# EAGLE design CFA_s (EAGLE 9.4.2)
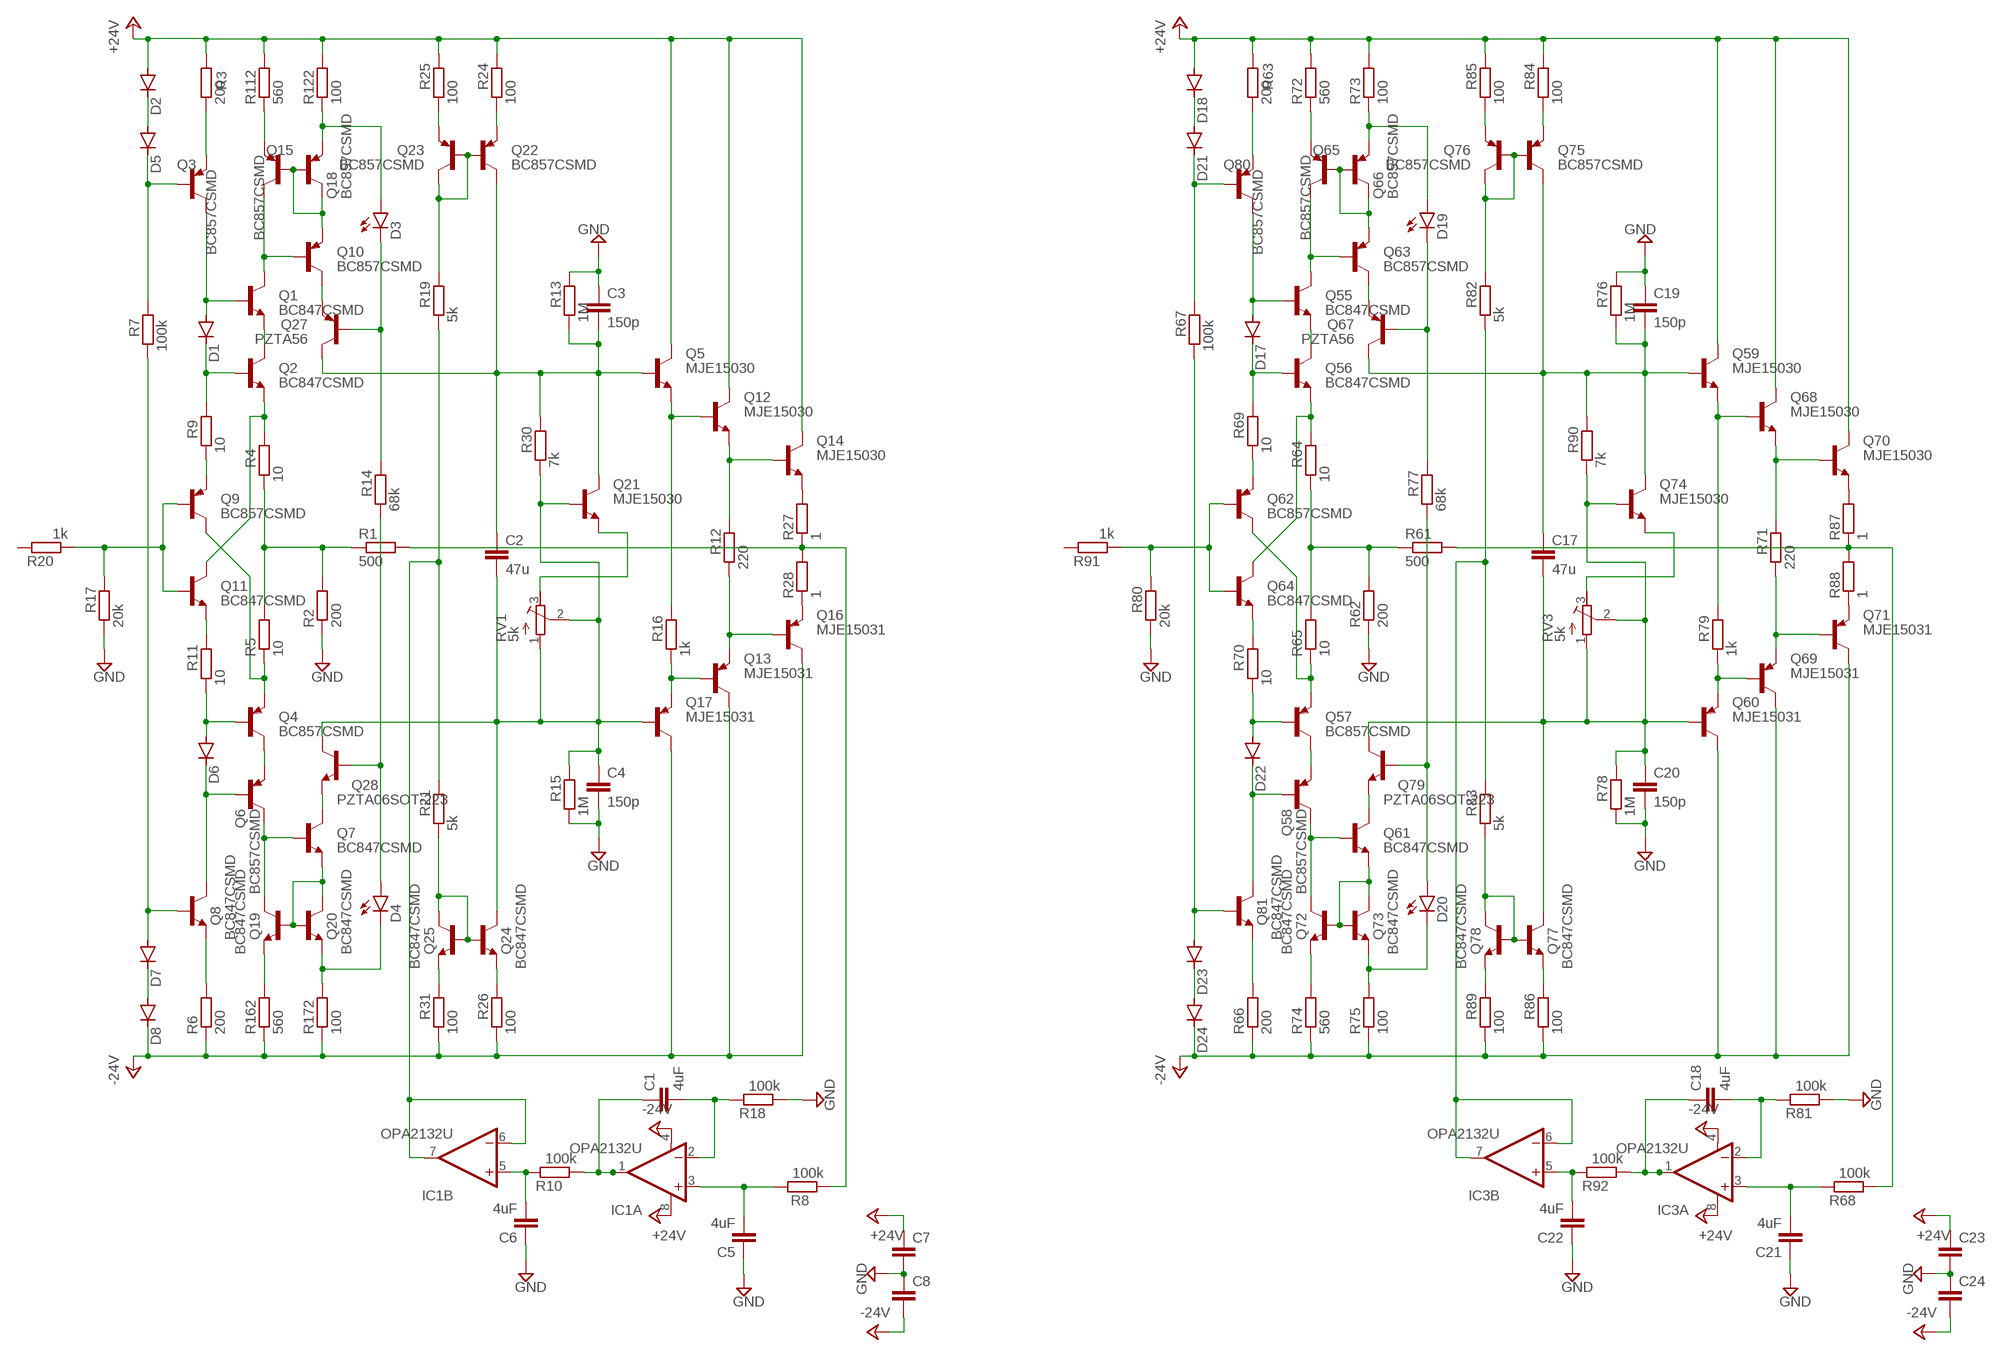
[diagram p0: schematic, sheet 1]

## Parts
C1  4uF  C-EUC1210  [C1210]
C2  47u  C-EUC1210  [C1210]
C3  150p  C-EUC0805  [C0805]
C4  150p  C-EUC0805  [C0805]
C5  4uF  C-EUC1210  [C1210]
C6  4uF  C-EUC1210  [C1210]
C7  C-EUC0603K  [C0603K]
C8  C-EUC0603K  [C0603K]
C17  47u  C-EUC1210  [C1210]
C18  4uF  C-EUC1210  [C1210]
C19  150p  C-EUC0805  [C0805]
C20  150p  C-EUC0805  [C0805]
C21  4uF  C-EUC1210  [C1210]
C22  4uF  C-EUC1210  [C1210]
C23  C-EUC0603K  [C0603K]
C24  C-EUC0603K  [C0603K]
D1  DIODE-SOD80C  [SOD80C]
D2  DIODE-SOD80C  [SOD80C]
D3  LEDCHIPLED_1206  [CHIPLED_1206]
D4  LEDCHIPLED_1206  [CHIPLED_1206]
D5  DIODE-SOD80C  [SOD80C]
D6  DIODE-SOD80C  [SOD80C]
D7  DIODE-SOD80C  [SOD80C]
D8  DIODE-SOD80C  [SOD80C]
D17  DIODE-SOD80C  [SOD80C]
D18  DIODE-SOD80C  [SOD80C]
D19  LEDCHIPLED_1206  [CHIPLED_1206]
D20  LEDCHIPLED_1206  [CHIPLED_1206]
D21  DIODE-SOD80C  [SOD80C]
D22  DIODE-SOD80C  [SOD80C]
D23  DIODE-SOD80C  [SOD80C]
D24  DIODE-SOD80C  [SOD80C]
IC1  OPA2132U  [SO08]
IC3  OPA2132U  [SO08]
Q1  BC847CSMD  [SOT23]
Q2  BC847CSMD  [SOT23]
Q3  BC857CSMD  [SOT23-BEC]
Q4  BC857CSMD  [SOT23-BEC]
Q5  MJE15030  MJD31C  [DPAK]
Q6  BC857CSMD  [SOT23-BEC]
Q7  BC847CSMD  [SOT23]
Q8  BC847CSMD  [SOT23]
Q9  BC857CSMD  [SOT23-BEC]
Q10  BC857CSMD  [SOT23-BEC]
Q11  BC847CSMD  [SOT23]
Q12  MJE15030  MJD31C  [DPAK]
Q13  MJE15031  MJD32C  [DPAK]
Q14  MJE15030  MJD31C  [DPAK]
Q15  BC857CSMD  [SOT23-BEC]
Q16  MJE15031  MJD32C  [DPAK]
Q17  MJE15031  MJD32C  [DPAK]
Q18  BC857CSMD  [SOT23-BEC]
Q19  BC847CSMD  [SOT23]
Q20  BC847CSMD  [SOT23]
Q21  MJE15030  MJD31C  [DPAK]
Q22  BC857CSMD  [SOT23-BEC]
Q23  BC857CSMD  [SOT23-BEC]
Q24  BC847CSMD  [SOT23]
Q25  BC847CSMD  [SOT23]
Q27  PZTA56  [SOT223]
Q28  PZTA06SOT-223  [SOT223]
Q55  BC847CSMD  [SOT23]
Q56  BC847CSMD  [SOT23]
Q57  BC857CSMD  [SOT23-BEC]
Q58  BC857CSMD  [SOT23-BEC]
Q59  MJE15030  MJD31C  [DPAK]
Q60  MJE15031  MJD32C  [DPAK]
Q61  BC847CSMD  [SOT23]
Q62  BC857CSMD  [SOT23-BEC]
Q63  BC857CSMD  [SOT23-BEC]
Q64  BC847CSMD  [SOT23]
Q65  BC857CSMD  [SOT23-BEC]
Q66  BC857CSMD  [SOT23-BEC]
Q67  PZTA56  [SOT223]
Q68  MJE15030  MJD31C  [DPAK]
Q69  MJE15031  MJD32C  [DPAK]
Q70  MJE15030  MJD31C  [DPAK]
Q71  MJE15031  MJD32C  [DPAK]
Q72  BC847CSMD  [SOT23]
Q73  BC847CSMD  [SOT23]
Q74  MJE15030  MJD31C  [DPAK]
Q75  BC857CSMD  [SOT23-BEC]
Q76  BC857CSMD  [SOT23-BEC]
Q77  BC847CSMD  [SOT23]
Q78  BC847CSMD  [SOT23]
Q79  PZTA06SOT-223  [SOT223]
Q80  BC857CSMD  [SOT23-BEC]
Q81  BC847CSMD  [SOT23]
R1  500  R-EU_MELF0204W  [MINI_MELF-0204W]
R2  200  R-EU_MELF0204W  [MINI_MELF-0204W]
R3  200  R-EU_MELF0204W  [MINI_MELF-0204W]
R4  10  R-EU_MELF0204W  [MINI_MELF-0204W]
R5  10  R-EU_MELF0204W  [MINI_MELF-0204W]
R6  200  R-EU_MELF0204W  [MINI_MELF-0204W]
R7  100k  R-EU_MELF0204W  [MINI_MELF-0204W]
R8  100k  R-EU_MELF0204W  [MINI_MELF-0204W]
R9  10  R-EU_MELF0204W  [MINI_MELF-0204W]
R10  100k  R-EU_MELF0204W  [MINI_MELF-0204W]
R11  10  R-EU_MELF0204W  [MINI_MELF-0204W]
R12  220  R-EU_MELF0204W  [MINI_MELF-0204W]
R13  1M  R-EU_MELF0204W  [MINI_MELF-0204W]
R14  68k  R-EU_MELF0204W  [MINI_MELF-0204W]
R15  1M  R-EU_MELF0204W  [MINI_MELF-0204W]
R16  1k  R-EU_MELF0204W  [MINI_MELF-0204W]
R17  20k  R-EU_MELF0204W  [MINI_MELF-0204W]
R18  100k  R-EU_MELF0204W  [MINI_MELF-0204W]
R19  5k  R-EU_MELF0204W  [MINI_MELF-0204W]
R20  1k  R-EU_MELF0204W  [MINI_MELF-0204W]
R21  5k  R-EU_MELF0204W  [MINI_MELF-0204W]
R24  100  R-EU_MELF0204W  [MINI_MELF-0204W]
R25  100  R-EU_MELF0204W  [MINI_MELF-0204W]
R26  100  R-EU_MELF0204W  [MINI_MELF-0204W]
R27  1  R-EU_R4527  [R4527]
R28  1  R-EU_R4527  [R4527]
R30  7k  R-EU_MELF0204W  [MINI_MELF-0204W]
R31  100  R-EU_MELF0204W  [MINI_MELF-0204W]
R61  500  R-EU_MELF0204W  [MINI_MELF-0204W]
R62  200  R-EU_MELF0204W  [MINI_MELF-0204W]
R63  200  R-EU_MELF0204W  [MINI_MELF-0204W]
R64  10  R-EU_MELF0204W  [MINI_MELF-0204W]
R65  10  R-EU_MELF0204W  [MINI_MELF-0204W]
R66  200  R-EU_MELF0204W  [MINI_MELF-0204W]
R67  100k  R-EU_MELF0204W  [MINI_MELF-0204W]
R68  100k  R-EU_MELF0204W  [MINI_MELF-0204W]
R69  10  R-EU_MELF0204W  [MINI_MELF-0204W]
R70  10  R-EU_MELF0204W  [MINI_MELF-0204W]
R71  220  R-EU_MELF0204W  [MINI_MELF-0204W]
R72  560  R-EU_MELF0204W  [MINI_MELF-0204W]
R73  100  R-EU_MELF0204W  [MINI_MELF-0204W]
R74  560  R-EU_MELF0204W  [MINI_MELF-0204W]
R75  100  R-EU_MELF0204W  [MINI_MELF-0204W]
R76  1M  R-EU_MELF0204W  [MINI_MELF-0204W]
R77  68k  R-EU_MELF0204W  [MINI_MELF-0204W]
R78  1M  R-EU_MELF0204W  [MINI_MELF-0204W]
R79  1k  R-EU_MELF0204W  [MINI_MELF-0204W]
R80  20k  R-EU_MELF0204W  [MINI_MELF-0204W]
R81  100k  R-EU_MELF0204W  [MINI_MELF-0204W]
R82  5k  R-EU_MELF0204W  [MINI_MELF-0204W]
R83  5k  R-EU_MELF0204W  [MINI_MELF-0204W]
R84  100  R-EU_MELF0204W  [MINI_MELF-0204W]
R85  100  R-EU_MELF0204W  [MINI_MELF-0204W]
R86  100  R-EU_MELF0204W  [MINI_MELF-0204W]
R87  1  R-EU_R4527  [R4527]
R88  1  R-EU_R4527  [R4527]
R89  100  R-EU_MELF0204W  [MINI_MELF-0204W]
R90  7k  R-EU_MELF0204W  [MINI_MELF-0204W]
R91  1k  R-EU_MELF0204W  [MINI_MELF-0204W]
R92  100k  R-EU_MELF0204W  [MINI_MELF-0204W]
R112  560  R-EU_MELF0204W  [MINI_MELF-0204W]
R122  100  R-EU_MELF0204W  [MINI_MELF-0204W]
R162  560  R-EU_MELF0204W  [MINI_MELF-0204W]
R172  100  R-EU_MELF0204W  [MINI_MELF-0204W]
RV1  5k  R-TRIMMTS63Y  [RTRIMTS63Y]
RV3  5k  R-TRIMMTS63Y  [RTRIMTS63Y]

## Nets
+24V: C7.1 C23.1 D2.A D18.A IC1.8(A:V+) IC3.8(A:V+) Q5.4(C) Q12.4(C) Q14.4(C) Q59.4(C) Q68.4(C) Q70.4(C) R3.2 R24.2 R25.2 R63.2 R72.2 R73.2 R84.2 R85.2 R112.2 R122.2
-24V: C8.2 C24.2 D8.C D24.C IC1.4(A:V-) IC3.4(A:V-) Q13.4(C) Q16.4(C) Q17.4(C) Q60.4(C) Q69.4(C) Q71.4(C) R6.1 R26.1 R31.1 R66.1 R74.1 R75.1 R86.1 R89.1 R162.1 R172.1
GND: C3.1 C4.2 C5.1 C6.1 C7.2 C8.1 C19.1 C20.2 C21.1 C22.1 C23.2 C24.1 R2.1 R13.2 R15.1 R17.1 R18.1 R62.1 R76.2 R78.1 R80.1 R81.1
N$1: Q21.3(E) RV1.3(E)
N$2: Q3.E R3.1
N$3: D1.A Q1.1(B) Q3.C
N$4: D2.C D5.A
N$5: D5.C Q3.B R7.2
N$6: D1.C Q2.1(B) R9.2
N$7: Q1.2(E) Q2.3(C)
N$8: Q2.2(E) Q11.3(C) R4.2
N$9: R1.1 R2.2 R4.1 R5.2
N$10: Q4.E Q9.C R5.1
N$11: Q4.C Q6.E
N$12: D6.A Q4.B R11.1
N$13: D6.C Q6.B Q8.3(C)
N$14: Q8.2(E) R6.2
N$15: D7.A Q8.1(B) R7.1
N$16: D7.C D8.A
N$17: C1.1 IC1.1(A:OUT) R10.1
N$18: C6.2 IC1.5(B:+IN) R10.2
N$19: Q9.E R9.1
N$20: Q11.2(E) R11.2
N$21: Q15.E R112.1
N$22: Q9.B Q11.1(B) R17.2 R20.1
N$23: Q1.3(C) Q10.B Q15.C
N$24: Q10.E Q15.B Q18.B Q18.C
N$25: D3.A Q18.E R122.1
N$26: Q10.C Q27.3(E)
N$27: D3.C Q27.1(B) R14.2
N$28: Q7.2(E) Q19.1(B) Q20.1(B) Q20.3(C)
N$29: D4.C Q20.2(E) R172.2
N$30: Q19.2(E) R162.2
N$31: Q6.C Q7.1(B) Q19.3(C)
N$32: Q7.3(C) Q28.3(E)
N$33: D4.A Q28.1(B) R14.1
N$35: Q12.3(E) Q14.1(B) R12.2
N$36: C2.1 C3.2 Q5.1(B) Q21.4(C) Q22.C Q27.2(C) Q27.4(C) R13.1 R30.2
N$37: Q22.B Q23.B Q23.C R19.2
N$38: Q24.1(B) Q25.1(B) Q25.3(C) R21.1
N$39: Q23.E R25.1
N$40: Q22.E R24.1
N$41: IC1.6(B:-IN) IC1.7(B:OUT) R19.1 R21.2
N$42: R1.2 R8.1 R27.1 R28.2
N$43: Q25.2(E) R31.2
N$44: Q24.2(E) R26.2
N$45: Q5.3(E) Q12.1(B) R16.2
N$47: Q13.1(B) Q17.3(E) R16.1
N$48: C2.2 C4.1 Q17.1(B) Q21.1(B) Q24.3(C) Q28.2(C) Q28.4(C) R15.2 R30.1 RV1.1(A) RV1.2(S)
N$50: Q13.3(E) Q16.1(B) R12.1
N$51: Q14.3(E) R27.2
N$52: Q16.3(E) R28.1
N$53: C1.2 IC1.2(A:-IN) R18.2
N$55: C5.2 IC1.3(A:+IN) R8.2
N$183: Q80.E R63.1
N$184: D17.A Q55.1(B) Q80.C
N$185: D18.C D21.A
N$186: D21.C Q80.B R67.2
N$187: D17.C Q56.1(B) R69.2
N$188: Q55.2(E) Q56.3(C)
N$189: Q56.2(E) Q64.3(C) R64.2
N$190: R61.1 R62.2 R64.1 R65.2
N$191: Q57.E Q62.C R65.1
N$192: D22.A Q57.B R70.1
N$193: D22.C Q58.B Q81.3(C)
N$194: Q81.2(E) R66.2
N$195: D23.C D24.A
N$196: Q57.C Q58.E
N$197: Q62.E R69.1
N$198: Q64.2(E) R70.2
N$199: Q62.B Q64.1(B) R80.2 R91.1
N$200: Q55.3(C) Q63.B Q65.C
N$201: Q63.E Q65.B Q66.B Q66.C
N$202: Q65.E R72.1
N$203: D19.A Q66.E R73.1
N$204: Q63.C Q67.3(E)
N$205: D19.C Q67.1(B) R77.2
N$206: Q61.2(E) Q72.1(B) Q73.1(B) Q73.3(C)
N$207: D20.C Q73.2(E) R75.2
N$208: Q72.2(E) R74.2
N$209: Q58.C Q61.1(B) Q72.3(C)
N$210: Q61.3(C) Q79.3(E)
N$211: D20.A Q79.1(B) R77.1
N$212: C17.1 C19.2 Q59.1(B) Q67.2(C) Q67.4(C) Q74.4(C) Q75.C R76.1 R90.2
N$213: Q75.B Q76.B Q76.C R82.2
N$214: Q77.1(B) Q78.1(B) Q78.3(C) R83.1
N$215: Q76.E R85.1
N$216: Q75.E R84.1
N$217: IC3.6(B:-IN) IC3.7(B:OUT) R82.1 R83.2
N$218: R61.2 R68.1 R87.1 R88.2
N$219: Q78.2(E) R89.2
N$220: Q77.2(E) R86.2
N$221: Q59.3(E) Q68.1(B) R79.2
N$222: Q60.3(E) Q69.1(B) R79.1
N$223: C17.2 C20.1 Q60.1(B) Q74.1(B) Q77.3(C) Q79.2(C) Q79.4(C) R78.2 R90.1 RV3.1(A) RV3.2(S)
N$224: Q68.3(E) Q70.1(B) R71.2
N$225: Q69.3(E) Q71.1(B) R71.1
N$226: Q70.3(E) R87.2
N$227: Q71.3(E) R88.1
N$228: C18.2 IC3.2(A:-IN) R81.2
N$229: C21.2 IC3.3(A:+IN) R68.2
N$230: D23.A Q81.1(B) R67.1
N$231: Q74.3(E) RV3.3(E)
N$232: C18.1 IC3.1(A:OUT) R92.1
N$233: C22.2 IC3.5(B:+IN) R92.2
Unconnected: R20.2 R91.2

## Library data of the parts
C1-C6 C17-C22 = Vwvwbg:C-EU: CAPACITOR, European symbol; SPICEPREFIX: C
C7 C8 C23 C24 = Vwvwbg:C-EU: CAPACITOR, European symbol
D1 D2 D5-D8 D17 D18 D21-D24 = diode:DIODE-: DIODE; SPICEPREFIX: D
D3 D4 D19 D20 = led:LED: LED OSRAM: - CHIPLED LG R971, LG N971, LY N971, LG Q971, LY Q971, LO R971, LY R971 LH N974, LH R974 LS Q976, LO Q976, LY Q976 LO Q996 - Hyper CHIPLED LW Q18S LB Q993, LB Q99A, LB R99A - SideLED LS A670, LO A670, LY A670, LG A670, LP A670 LB A673, LV A673, LT A673, LW A673 LH A674 LY A675 LS A676, LA A676, LO A676, LY A676, LW A676 LS A679, LY A679, LG A679 - Hyper Micro SIDELED® LS Y876, LA Y876, LO Y876, LY Y876 LT Y87S - SmartLED LW L88C, LW L88S LB L89C, LB L89S, LG L890 LS L89K, LO L89K, LY L89K LS L896, LA L896, LO L896, LY L896 - TOPLED LS T670, LO T670, LY T670, LG T670, LP T670 LSG T670, LSP T670, LSY T670, LOP T670, LYG T670 LG T671, LOG T671, LSG T671 LB T673, LV T673, LT T673, LW T673 LH T674 LS T676, LA T676, LO T676, LY T676, LB T676, LH T676, LSB T676, LW T676 LB T67C, LV T67C, LT T67C, LS T67K, LO T67K, LY T67K, LW E67C LS E67B, LA E67B, LO E67B, LY E67B, LB E67C, LV E67C, LT E67C LW T67C LS T679, LY T679, LG T679 LS T770, LO T770, LY T770, LG T770, LP T770 LB T773, LV T773, LT T773, LW T773 LH T774 LS E675, LA E675, LY E675, LS T675 LS T776, LA T776, LO T776, LY T776, LB T776 LHGB T686 LT T68C, LB T68C - Hyper Mini TOPLED® LB M676 - Mini TOPLED Santana® LG M470 LS M47K, LO M47K, LY M47K Source: http://www.osram.convergy.de LUXEON: - LUMILED® LXK2-PW12-R00, LXK2-PW12-S00, LXK2-PW14-U00, LXK2-PW14-V00 LXK2-PM12-R00, LXK2-PM12-S00, LXK2-PM14-U00 LXK2-PE12-Q00, LXK2-PE12-R00, LXK2-PE12-S00, LXK2-PE14-T00, LXK2-PE14-U00 LXK2-PB12-K00, LXK2-PB12-L00, LXK2-PB12-M00, LXK2-PB14-N00, LXK2-PB14-P00, LXK2-PB14-Q00 LXK2-PR12-L00, LXK2-PR12-M00, LXK2-PR14-Q00, LXK2-PR14-R00 LXK2-PD12-Q00, LXK2-PD12-R00, LXK2-PD12-S00 LXK2-PH12-R00, LXK2-PH12-S00 LXK2-PL12-P00, LXK2-PL12-Q00, LXK2-PL12-R00 Source: www.luxeon.com KINGBRIGHT: KA-3528ASYC Source: www.kingbright.com; SPICEPREFIX: D
IC1 IC3 = burr-brown:OPA2132: High Speed FET-Input Operational Amplifiers< Product Folder:OPA2132; MF: TEXAS INSTRUMENTS; MPN: OPA2132U; OC_FARNELL: 1206934; OC_NEWARK: 80K6015
Q1 Q2 Q7 Q8 Q11 Q19 Q20 Q24 Q25 Q55 Q56 Q61 Q64 Q72 Q73 Q77 Q78 Q81 = transistor-npn:BC847*: NPN Transistor; SPICEPREFIX: Q
Q3 Q4 Q6 Q9 Q10 Q15 Q18 Q22 Q23 Q57 Q58 Q62 Q63 Q65 Q66 Q75 Q76 Q80 = transistor-pnp:BC857*: PNP Transistror; SPICEPREFIX: Q
Q5 Q12 Q14 Q21 Q59 Q68 Q70 Q74 = transistor:MJD31*: Complementary Power Transistors; SPICEPREFIX: Q
Q13 Q16 Q17 Q60 Q69 Q71 = transistor:MJD32*: Complementary Power Transistors; SPICEPREFIX: Q
Q27 Q67 = Vwvwbg:PZTA56; SPICEPREFIX: Q
Q28 Q79 = Vwvwbg:PZTA06; SPICEPREFIX: Q
R1-R21 R24-R28 R30 R31 R61-R92 R112 R122 R162 R172 = Vwvwbg:R-EU_: RESISTOR, European symbol; SPICEPREFIX: R
RV1 RV3 = Vwvwbg:R-TRIMM: Trimm resistor; SPICEMODEL: X; SPICEPREFIX: Z; SPICEPREFIXL: POT

## Board
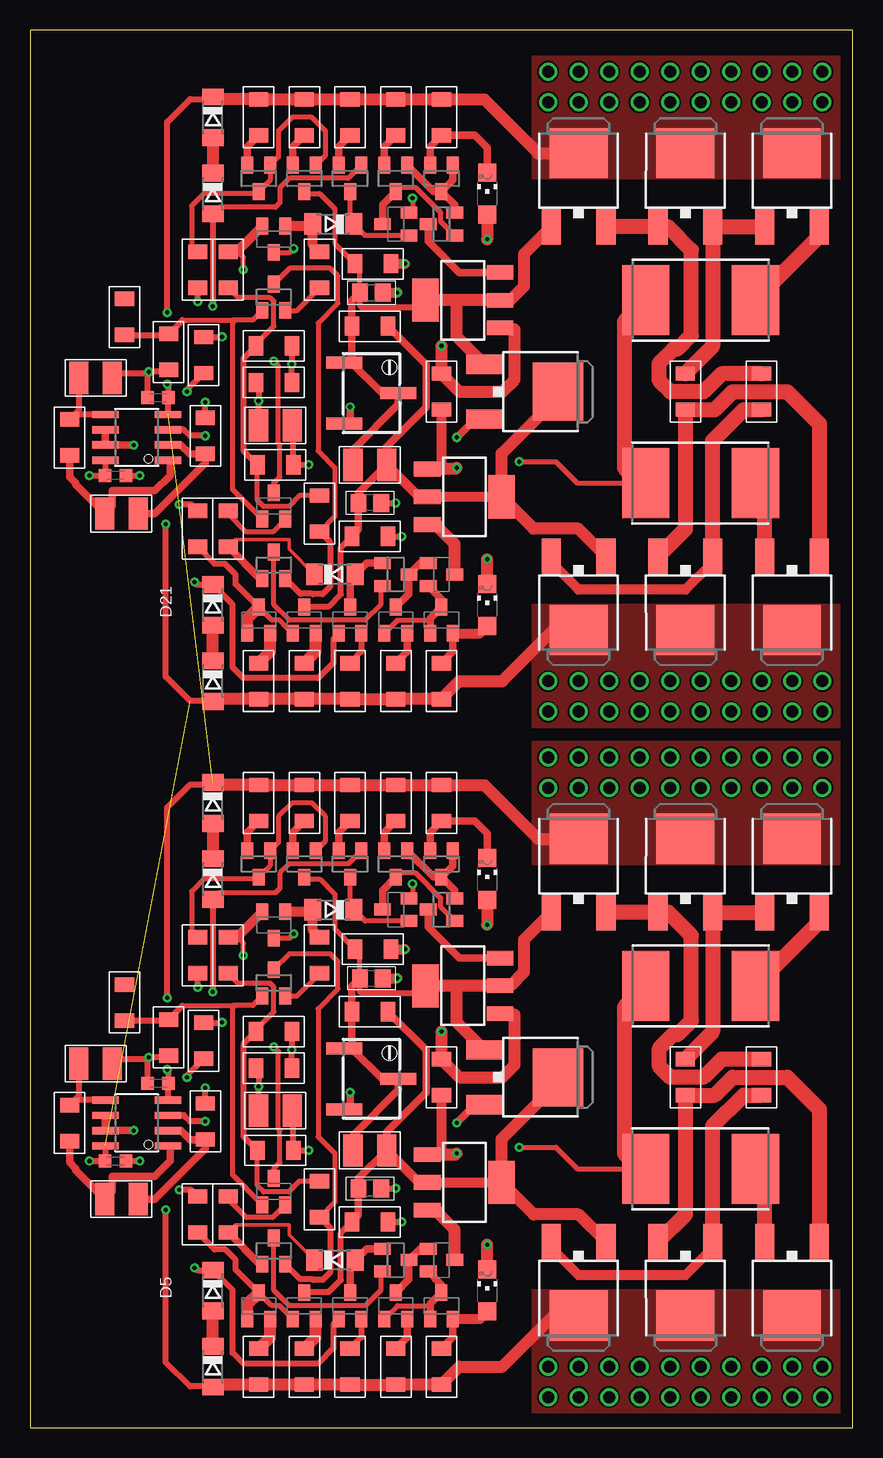
[diagram p1: board, top side]
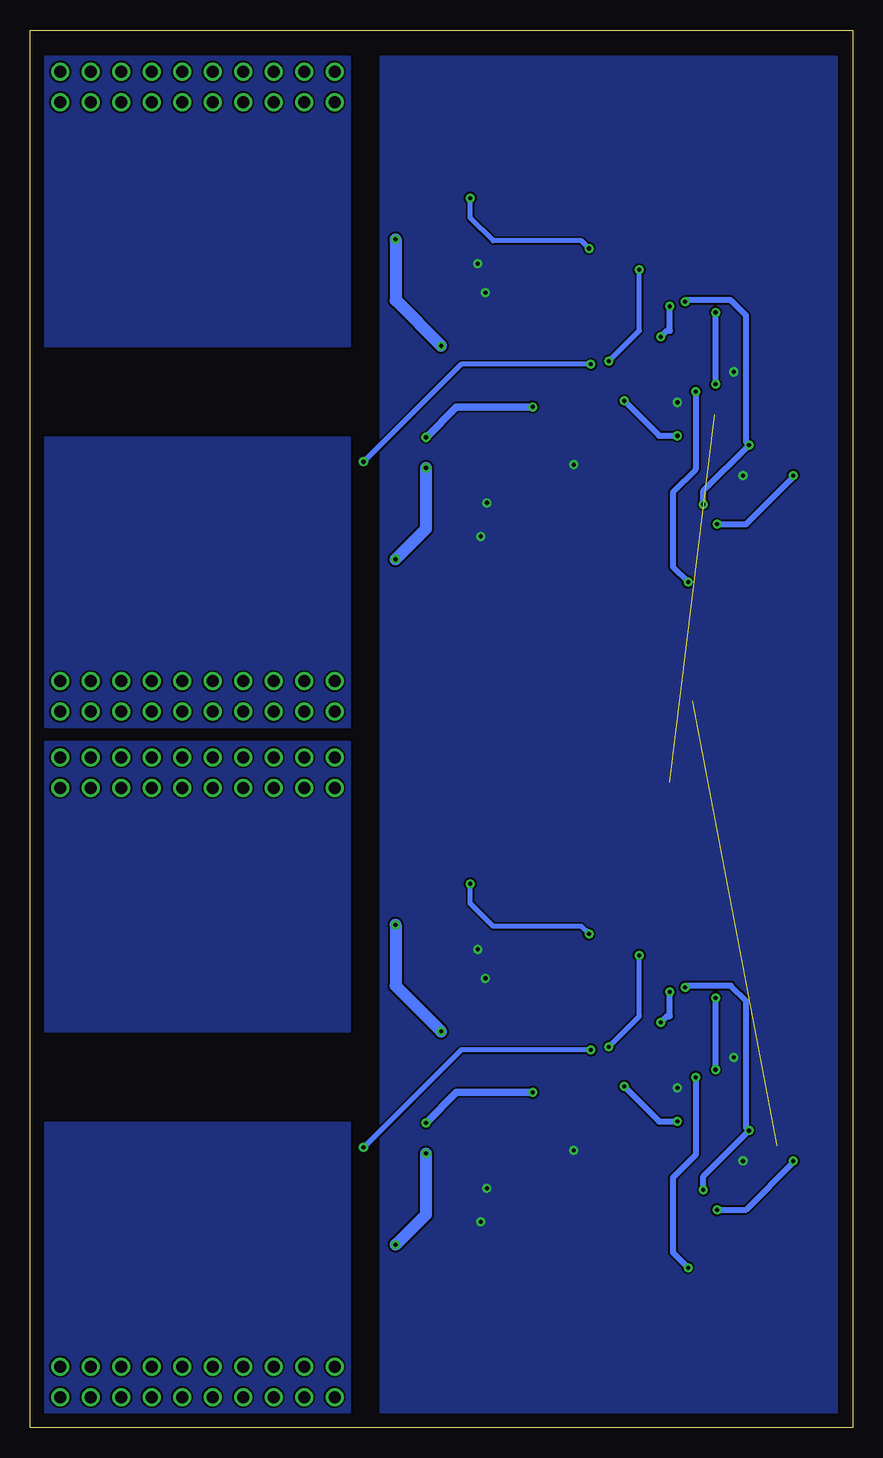
[diagram p2: board, bottom side, seen from below]

Size 68.56 x 116.51 mm. Coordinates in mm from the lower left corner, seen from the top.
Outline: 0,0 68.56,0 68.56,116.51 0,116.51 0,0
Copper layers (1*16): Top 0.035mm / dielectric 1.5mm / Bottom 0.035mm
Design rules "default *": minimum track width 6mil, minimum drill 0.35mm, track to track 6mil, track to pad 6mil, pad to pad 6mil, via to via 6mil, smd to smd 6mil, copper to edge 40mil, drill to drill 6mil, minimum pad ring 10mil, minimum via ring 8mil, stop-mask expansion 4mil, vias tented up to drill 0.35mm, thermal gap 10mil

### Footprints (pad centres in the part's own frame; a part is rotated, then mirrored left to right if it is on the bottom)
C1210 = smd 1.6 x 2.7: 1 -1.4,0; 2 1.4,0
C0805 = smd 1.3 x 1.5: 1 -0.95,0; 2 0.95,0
C0603K = smd 1.05 x 1.08: 1 -0.875,0; 2 0.875,0
SOD80C = smd 1.4 x 1.8: A 1.7,0; C -1.7,0
CHIPLED_1206 = smd 1.5 x 1.5: A 0,-1.75; C 0,1.75
SO08 = smd 0.61 x 2.21: 1 -1.905,-2.616; 2 -0.635,-2.616; 3 0.635,-2.616; 4 1.905,-2.616; 5 1.905,2.616; 6 0.635,2.616; 7 -0.635,2.616; 8 -1.905,2.616
SOT23 = smd 1 x 1.4: 1 -0.95,-1.1; 2 0.95,-1.1; 3 0,1.1
SOT23-BEC = smd 1 x 1.4: B -0.95,-1.1; C 0,1.1; E 0.95,-1.1
DPAK = smd 1.6 x 3: 1 -2.28,-4.04; 3 2.28,-4.04 | smd 4.826 x 4.191: 4 0,2.096
SOT223 = smd 1.219 x 2.235: 1 -2.311,-3.099; 2 0,-3.099; 3 2.311,-3.099 | smd 3.6 x 2.2: 4 0,3.099
MINI_MELF-0204W = smd 1.2 x 1.6: 1 -1.5,0; 2 1.5,0
R4527 = smd 3.94 x 5.84: 1 -4.575,0; 2 4.575,0
RTRIMTS63Y = smd 1 x 3: 1 -2.55,-2.25; 2 0,2.25; 3 2.55,-2.25

### Placement (x,y rotation side)
C1  7.62,19.05 0 top
C2  28.32,23.11 180 top
C3  28.32,19.94 180 top
C4  28.45,37.47 0 top
C5  20.45,26.42 180 top
C6  5.46,30.35 180 top
C7  7.11,22.22 0 top
C8  10.67,28.7 0 top
C17  28.32,80.26 180 top
C18  7.62,76.2 0 top
C19  28.32,77.09 180 top
C20  28.45,94.61 0 top
C21  20.45,83.57 180 top
C22  5.46,87.5 180 top
C23  7.11,79.38 0 top
C24  10.67,85.85 0 top
D1  25.4,13.97 0 top
D2  15.24,5.08 270 top
D3  38.1,11.43 0 top
D4  38.1,45.72 0 top
D5  15.24,11.43 270 top
D6  25.27,43.18 180 top
D7  15.24,45.72 270 top
D8  15.24,52.07 270 top
D17  25.4,71.12 0 top
D18  15.24,62.23 270 top
D19  38.1,68.58 0 top
D20  38.1,102.87 0 top
D21  15.24,68.58 270 top
D22  25.27,100.33 180 top
D23  15.24,102.87 270 top
D24  15.24,109.22 270 top
IC1  8.89,25.4 90 top
IC3  8.89,82.55 90 top
Q1  30.48,13.97 270 top
Q2  20.32,14.73 0 top
Q3  26.67,10.16 0 top
Q4  20.32,41.91 180 top
Q5  45.72,11.43 180 top
Q6  30.48,43.18 90 top
Q7  34.29,43.18 90 top
Q8  26.67,46.99 180 top
Q9  20.32,19.68 0 top
Q10  34.29,13.97 270 top
Q11  20.32,37.08 0 top
Q12  54.61,11.43 180 top
Q13  54.61,46.99 0 top
Q14  63.5,11.43 180 top
Q15  30.48,10.16 0 top
Q16  63.5,46.99 0 top
Q17  45.72,46.99 0 top
Q18  34.29,10.16 0 top
Q19  30.48,46.99 180 top
Q20  34.29,46.99 180 top
Q21  41.91,29.21 270 top
Q22  22.86,10.16 0 top
Q23  19.05,10.16 0 top
Q24  22.86,46.99 180 top
Q25  19.05,46.99 180 top
Q27  36.2,20.45 270 top
Q28  36.07,36.83 90 top
Q55  30.48,71.12 270 top
Q56  20.32,71.88 0 top
Q57  20.32,99.06 180 top
Q58  30.48,100.33 90 top
Q59  45.72,68.58 180 top
Q60  45.72,104.14 0 top
Q61  34.29,100.33 90 top
Q62  20.32,76.83 0 top
Q63  34.29,71.12 270 top
Q64  20.32,94.23 0 top
Q65  30.48,67.31 0 top
Q66  34.29,67.31 0 top
Q67  36.2,77.6 270 top
Q68  54.61,68.58 180 top
Q69  54.61,104.14 0 top
Q70  63.5,68.58 180 top
Q71  63.5,104.14 0 top
Q72  30.48,104.14 180 top
Q73  34.29,104.14 180 top
Q74  41.91,86.36 270 top
Q75  22.86,67.31 0 top
Q76  19.05,67.31 0 top
Q77  22.86,104.14 180 top
Q78  19.05,104.14 180 top
Q79  36.07,93.98 90 top
Q80  26.67,67.31 0 top
Q81  26.67,104.14 180 top
R1  20.32,33.02 0 top
R2  20.45,23.11 180 top
R3  26.67,5.08 270 top
R4  24.13,19.05 270 top
R5  16.51,39.37 270 top
R6  26.67,52.07 270 top
R7  14.48,32.26 270 top
R8  20.32,29.97 180 top
R9  16.51,17.78 270 top
R10  3.3,25.4 90 top
R11  24.13,39.37 270 top
R12  54.61,29.21 270 top
R13  28.32,17.14 0 top
R14  34.29,29.21 270 top
R15  28.57,39.88 180 top
R16  60.96,29.21 270 top
R17  11.56,32.51 90 top
R18  14.61,25.53 270 top
R19  13.97,17.78 270 top
R20  7.87,35.43 90 top
R21  13.97,39.37 270 top
R24  22.86,5.08 270 top
R25  19.05,5.08 270 top
R26  22.86,52.07 270 top
R27  55.88,21.59 0 top
R28  55.88,36.83 180 top
R30  28.32,34.67 0 top
R31  19.05,52.07 270 top
R61  20.32,90.17 0 top
R62  20.45,80.26 180 top
R63  26.67,62.23 270 top
R64  24.13,76.2 270 top
R65  16.51,96.52 270 top
R66  26.67,109.22 270 top
R67  14.48,89.41 270 top
R68  20.32,87.12 180 top
R69  16.51,74.93 270 top
R70  24.13,96.52 270 top
R71  54.61,86.36 270 top
R72  30.48,62.23 270 top
R73  34.29,62.23 270 top
R74  30.48,109.22 270 top
R75  34.29,109.22 270 top
R76  28.32,74.3 0 top
R77  34.29,86.36 270 top
R78  28.57,97.03 180 top
R79  60.96,86.36 270 top
R80  11.56,89.66 90 top
R81  14.61,82.68 270 top
R82  13.97,74.93 270 top
R83  13.97,96.52 270 top
R84  22.86,62.23 270 top
R85  19.05,62.23 270 top
R86  22.86,109.22 270 top
R87  55.88,78.74 0 top
R88  55.88,93.98 180 top
R89  19.05,109.22 270 top
R90  28.32,91.82 0 top
R91  7.87,92.58 90 top
R92  3.3,82.55 90 top
R112  30.48,5.08 270 top
R122  34.29,5.08 270 top
R162  30.48,52.07 270 top
R172  34.29,52.07 270 top
RV1  28.45,29.08 270 top
RV3  28.45,86.23 270 top

### Tracks (layer width: path | path; a pad name or v marks a point on that pad's centre or on a via)
+24V  (via drill 0.35)  (1 unrouted)
  Top 0.508: IC1.8 6.27,22.26 C7.1 v4.95,22.22 | D2.A 15.19,3.43 13.34,3.43 11.3,5.46 v11.3,18.16 | IC3.8 6.27,79.41 C23.1 v4.95,79.38 | D18.A 15.19,60.58 13.34,60.58 11.3,62.61 v11.3,75.31
  Top 1.016: D2.A 15.44,3.58 R25.2 R24.2 R3.2 R112.2 R122.2 35.79,5.08 39.37,5.08 44.45,10.16 44.89,10.16 Q5.4 | D18.A 15.44,60.73 R85.2 R84.2 R63.2 R72.2 R73.2 35.79,62.23 39.37,62.23 44.45,67.31 44.89,67.31 Q59.4
  Bottom 0.508: v11.3,18.16 8.89,18.16 4.95,22.1 v4.95,22.22 | v11.3,75.31 8.89,75.31 4.95,79.25 v4.95,79.38
  pour Top (no thermals): 41.91,11.43 68.58,11.43 68.58,1.27 41.91,1.27
  pour Bottom: 41.91,25.4 67.31,25.4 67.31,1.27 41.91,1.27
  pour Top (no thermals): 41.91,68.58 68.58,68.58 68.58,58.42 41.91,58.42
  pour Bottom: 41.91,82.55 67.31,82.55 67.31,58.42 41.91,58.42
-24V  (via drill 0.35)  (1 unrouted)
  Top 0.508: IC1.4 11.51,28.66 C8.2 11.54,29.73 v11.43,29.84 | v11.43,35.81 11.43,51.69 13.34,53.59 15.42,53.59 15.44,53.57 | IC3.4 11.51,85.81 C24.2 11.54,86.88 v11.43,86.99 | v11.43,92.96 11.43,108.84 13.34,110.74 15.42,110.74 15.44,110.72
  Top 1.016: D8.C 15.44,53.57 R31.1 R26.1 R6.1 R162.1 R172.1 37.87,53.57 42.35,49.09 Q17.4 | D24.C 15.44,110.72 R89.1 R86.1 R66.1 R74.1 R75.1 37.87,110.72 42.35,106.24 Q60.4
  Bottom 0.508: v11.43,29.84 v11.43,35.81 | v11.43,86.99 v11.43,92.96
  pour Top (no thermals): 41.91,57.15 68.58,57.15 68.58,46.99 41.91,46.99
  pour Bottom: 41.91,57.15 67.31,57.15 67.31,33.02 41.91,33.02
  pour Top (no thermals): 41.91,114.3 68.58,114.3 68.58,104.14 41.91,104.14
  pour Bottom: 41.91,114.3 67.31,114.3 67.31,90.17 41.91,90.17
GND  (via drill 0.35)
  Top 0.508: R18.1 v14.61,28.32 | R17.1 11.41,30.86 v9.91,30.86 9.79,30.75 | C8.1 9.79,30.75 | C6.1 7.26,30.75 9.79,30.75 | C7.2 v9.14,22.22 | C5.1 21.95,26.32 R2.1 v23.24,23.11 | C3.1 v30.48,19.94 | R13.2 v30.99,17.14 | R81.1 v14.61,85.47 | R80.1 11.41,88.01 v9.91,88.01 9.79,87.9 | C24.1 9.79,87.9 | C22.1 7.26,87.9 9.79,87.9 | C23.2 v9.14,79.38 | C21.1 21.95,83.47 R62.1 v23.24,80.26 | C19.1 v30.48,77.09 | R76.2 v30.99,74.3
  Top 0.813: C4.2 v30.61,37.47 | R15.1 v31.24,39.88 | C20.2 v30.61,94.61 | R78.1 v31.24,97.03
  pour Bottom: 1.27,114.3 39.37,114.3 39.37,1.27 1.27,1.27
N$1  (via drill 0.35)
  Top 0.61: RV1.3 26.67,27 v26.67,27.94 | v35.56,25.4 37.09,26.93 Q21.3
  Bottom 0.61: v26.67,27.94 33.02,27.94 v35.56,25.4
N$2
  Top 0.508: Q3.E 27.62,7.53 R3.1
N$3
  Top 0.61: Q1.1 28.05,14.92 D1.A 26.67,13.54 Q3.C
N$4
  Top 1.016: D2.C D5.A
N$5  (via drill 0.35)
  Top 0.508: Q3.B 25.27,8.61 25.27,6.6 24,5.33 17.78,5.33 16.89,6.22 16.89,11.48 D5.C 13.92,13.13 v13.72,13.33 | R7.2 13.08,29.36 v13.08,29.21
  Bottom 0.508: v13.72,13.33 14.99,14.61 14.99,20.83 13.08,22.73 v13.08,29.21
N$6
  Top 0.305: D1.C 21.59,16.08 21.59,16.89 17.12,16.89 R9.2
  Top 0.61: Q2.1 19.16,13.63 R9.2
N$7
  Top 0.406: Q1.2 29.21,12.85 29.21,11.43 27.94,10.16 21.59,10.16 20.32,11.43 Q2.3
N$8
  Top 0.406: Q11.3 21.63,39.5 25.02,39.5 25.65,38.86 25.65,36.58 24,34.93 24,24.26 25.4,22.86 25.4,18.82 R4.2
  Top 0.508: R4.2 25.02,16.66 25.02,12.95 24.38,12.32 23.58,12.32 23.53,12.37 22.54,12.37 Q2.2
N$9
  Top 0.406: R4.1 22.45,20.55 21.55,19.64 19.48,19.64 18.95,20.17 R2.2 | R1.1 18.82,33.17 20.32,34.67 20.32,36.74 20.02,37.04 17.34,37.04 R5.2
  Top 0.508: R2.2 17.78,24.28 17.78,31.98 R1.1
N$10  (via drill 0.35)
  Top 0.406: Q9.C 20.32,21.59 20.83,22.1 20.83,24.78 20.69,24.92 20.69,31.38 v20.32,31.75 | v17.78,39.37 17.78,40.4 17.31,40.87 R5.1
  Top 0.813: Q4.E 17.23,40.87 R5.1
  Bottom 0.406: v20.32,31.75 17.78,34.29 v17.78,39.37
N$11  (via drill 0.35)
  Top 0.406: Q4.C 21.63,40.81 v21.97,41.15 | v31.88,45.34 31.88,44.43 Q6.E
  Bottom 0.406: v21.97,41.15 22.61,41.78 29.97,41.78 31.88,43.69 v31.88,45.34
N$12
  Top 0.813: R11.1 23.57,41.43 D6.A 23.4,43.01 Q4.B
N$13
  Top 0.406: Q8.3 26.67,43.48 D6.C 27.92,42.23 Q6.B
N$14
  Top 0.61: R6.2 25.72,49.62 Q8.2
N$15  (via drill 0.35)
  Top 0.406: Q8.1 26.52,46.99 21.59,46.99 20.83,46.23 20.83,44.96 20.45,44.58 15.8,44.58 D7.A
  Top 0.508: D7.A v15.24,36.32 | R7.1 15.98,33.76 v16,33.78
  Bottom 0.508: v15.24,36.32 15.24,34.29 15.49,34.29 v16,33.78
N$16
  Top 1.016: D8.A D7.C
N$17
  Top 0.61: R10.1 3.3,22.1 3.81,21.59 3.81,21.46 C1.1 6.86,19.69 6.86,20.95 10.41,20.95 11.68,22.22 11.68,23.32 IC1.1
N$18
  Top 0.508: C6.2 4.06,27.66 R10.2 3.71,27.3 IC1.5
N$19
  Top 0.406: Q9.E 20.21,17.53 18.03,17.53 16.51,19.05 R9.1
N$20
  Top 0.406: Q11.2 22.24,35.98 R11.2
N$21
  Top 0.61: R112.1 31.43,7.53 Q15.E
N$22
  Top 0.406: Q9.B 16.89,21.06 16.89,34.93 17.02,35.05 16.89,35.18 | 12.72,35.18 16.89,35.18 | Q11.1 18.57,35.18 16.89,35.18
  Top 0.508: R20.1 11.48,33.93 R17.2 12.72,35.18
N$23
  Top 0.61: Q10.B 32.53,14.92 Q1.3 31.58,12.36 Q15.C
N$24
  Top 0.406: Q15.B 30.63,10.16 33.19,10.16 33.34,10.31
  Top 0.61: Q10.E 34.29,11.92 Q18.C 33.34,10.31 Q18.B
N$25
  Top 0.61: R122.1 35.24,7.53 Q18.E
  Top 0.813: Q18.E 37.48,9.06 D3.A
N$26
  Top 0.61: 33.93,18.14 Q27.3
  Top 1.016: Q10.C 35.39,16.51 33.93,17.97 33.93,18.14
N$27  (via drill 0.35)
  Top 0.813: R14.2 34.29,22.76
  Top 1.016: D3.C v38.1,15.24 | v35.56,22.86 35.46,22.76 34.29,22.76 Q27.1
  Bottom 1.016: v38.1,15.24 35.56,17.78 v35.56,22.86
N$28
  Top 0.61: Q20.1 35.24,46.84 Q20.3 | Q20.3 35.39,44.79 Q7.2 | Q20.3 33.63,45.89 Q19.1
N$29
  Top 0.61: Q20.2 33.34,49.62 R172.2 37.06,50.57 38.1,49.53 D4.C
N$30
  Top 0.61: R162.2 29.53,49.62 Q19.2
N$31
  Top 0.406: Q7.1 34.25,43.37 34.25,44.11 32.13,46.23 30.82,46.23 Q19.3
  Top 0.61: Q19.3 29.38,44.79 Q6.C
N$32
  Top 0.61: Q7.3 33.19,41.74 35.79,39.14 Q28.3
N$33  (via drill 0.35)
  Top 0.61: 40.39,34.42 39.27,34.42 Q28.1
  Top 1.016: 40.39,34.42 40.39,30.23 39.37,29.21 35.79,29.21 R14.1 v34.29,33.02 | D4.A v38.1,41.91
  Bottom 1.016: v38.1,41.91 38.1,36.83 v34.29,33.02
N$34  (via drill 1)
  other vias: 43.18,53.34
N$35
  Top 1.27: Q12.3 54.61,17.75 R12.2 57.05,27.71 58.55,29.21 63.12,29.21 65.78,26.55 Q14.1
N$36
  Top 0.508: Q22.C 22.9,11.3 24.89,11.3 25.91,12.32 25.91,16.23 R13.1
  Top 0.61: R30.2 33.02,31.47 33.02,27.94 29.72,24.64 C2.1 27.37,20.76 C3.2 27.37,17.7 R13.1
  Top 0.813: C2.1 32.39,20.45 Q27.2 Q27.4
  Top 1.016: Q21.4 44.01,28.77 39.29,24.05 Q27.4 41.96,17.78 45.69,17.78 Q5.1
N$37
  Top 0.406: Q22.B 21.37,9.6 21.36,9.6 20.8,10.16 20.15,10.16 Q23.C
  Top 0.508: Q23.C 17.14,13.16 17.14,13.97 16.26,14.86 15.39,14.86 R19.2
  Top 1.016: Q23.B 18.1,10.31 Q23.C
N$38
  Top 0.406: Q24.1 24.64,48.92 24.64,50.93 23.5,52.07 21.84,52.07 20.7,50.93 20.7,48.79 Q25.1 20,46.84 Q25.3 18.88,45.72 14.48,45.72 13.46,44.7 13.46,41.38 R21.1
N$39
  Top 1.016: R25.1 20,7.53 Q23.E
N$40
  Top 1.016: R24.1 23.81,7.53 Q22.E
N$41  (via drill 0.35)
  Top 0.508: 13.69,19.56 13.44,19.81 v12.45,19.81 | v13.97,36.7 R21.2
  Top 0.61: IC1.6 IC1.7 v8.64,24.77 | R19.1 13.69,19.56
  Bottom 0.508: v12.45,19.81 12.45,20.95 v8.64,24.77 8.89,25.02 8.89,35.56 10.16,36.83 13.97,36.83 v13.97,36.7
N$42  (via drill 0.35)
  Top 0.406: 21.82,31.75 v21.82,31.5 | v40.77,23.37 43.81,23.37 45.59,21.59 50.8,21.59 R27.1
  Top 0.508: R8.1 v21.82,31.5 | R1.2 21.82,31.75
  Top 1.27: R28.2 49.53,35.05 49.53,22.86 50.8,21.59
  Bottom 0.406: v21.82,31.5 32.64,31.5 v40.77,23.37
N$43
  Top 0.61: R31.2 18.1,49.62 Q25.2
N$44
  Top 0.61: R26.2 21.91,49.62 Q24.2
N$45
  Top 0.813: Q12.1 56.89,14.98 54.61,12.7 45.72,12.7 43.18,15.24 43.41,15.47 Q5.3
  Top 1.27: Q12.1 56.89,25.14 59.46,27.71 R16.2
N$46  (via drill 1)
  other vias: 45.72,53.34
N$47
  Top 1.27: R16.1 57.63,30.71 56.13,29.21 53.34,29.21 52.45,30.1 52.45,31.62 53.59,32.77 53.98,32.77 55.12,33.91 55.12,41.02 53.19,42.95 Q13.1 Q17.3
N$48
  Top 0.406: Q24.3 23.03,45.72 24.13,45.72 25.4,44.45 25.4,41.55 R15.2 27.5,39.46 C4.1
  Top 0.508: Q28.4 32.33,36.2 27.69,36.2 27.5,36.38 C4.1
  Top 0.61: 26.79,31.63 RV1.1 | 26.79,31.63 29.34,29.08 RV1.2 30.7,28.16 26.92,24.38 C2.2 | 26.79,31.63 26.82,31.67 R30.1 26.82,36.79 C4.1
  Top 1.016: 35.56,36.83 Q28.4 | Q21.1 35.56,33.8 35.56,36.83 | Q17.1 41.15,40.66 41.15,37.97 40.01,36.83 Q28.2 35.56,36.83
N$49  (via drill 1)
  other vias: 48.26,53.34
N$50
  Top 1.27: R12.1 56.89,32.99 Q13.3 Q16.1
N$51
  Top 1.27: Q14.3 61.22,20.82 R27.2
N$52
  Top 1.27: Q16.3 65.78,42.16 R28.1
N$53
  Top 0.61: C1.2 10.41,19.05 14.61,23.24 R18.2 14.58,24 13.34,24 12.57,24.77 IC1.2
N$54  (via drill 1)
  other vias: 50.8,53.34
N$55  (via drill 0.35)
  Top 0.508: R8.2 19.05,29.75 v19.05,28.45 C5.2 | v14.61,25.53 13.34,25.53 12.83,26.04 IC1.3
  Bottom 0.508: v19.05,28.45 16.13,25.53 v14.61,25.53
N$56  (via drill 1)
  other vias: 53.34,53.34
N$57  (via drill 1)
  other vias: 55.88,53.34
N$58  (via drill 1)
  other vias: 58.42,53.34
N$59  (via drill 1)
  other vias: 60.96,53.34
N$60  (via drill 1)
  other vias: 63.5,53.34
N$61  (via drill 1)
  other vias: 66.04,53.34
N$62  (via drill 1)
  other vias: 66.04,55.88
N$63  (via drill 1)
  other vias: 63.5,55.88
N$64  (via drill 1)
  other vias: 60.96,55.88
N$65  (via drill 1)
  other vias: 58.42,55.88
N$66  (via drill 1)
  other vias: 55.88,55.88
N$67  (via drill 1)
  other vias: 53.34,55.88
N$68  (via drill 1)
  other vias: 50.8,55.88
N$69  (via drill 1)
  other vias: 48.26,55.88
N$70  (via drill 1)
  other vias: 45.72,55.88
N$71  (via drill 1)
  other vias: 43.18,55.88
N$72  (via drill 1)
  other vias: 43.18,5.08
N$73  (via drill 1)
  other vias: 45.72,5.08
N$74  (via drill 1)
  other vias: 48.26,5.08
N$75  (via drill 1)
  other vias: 50.8,5.08
N$76  (via drill 1)
  other vias: 53.34,5.08
N$77  (via drill 1)
  other vias: 55.88,5.08
N$78  (via drill 1)
  other vias: 58.42,5.08
N$79  (via drill 1)
  other vias: 60.96,5.08
N$80  (via drill 1)
  other vias: 63.5,5.08
N$81  (via drill 1)
  other vias: 66.04,5.08
N$82  (via drill 1)
  other vias: 66.04,2.54
N$83  (via drill 1)
  other vias: 63.5,2.54
N$84  (via drill 1)
  other vias: 60.96,2.54
N$85  (via drill 1)
  other vias: 58.42,2.54
N$86  (via drill 1)
  other vias: 55.88,2.54
N$87  (via drill 1)
  other vias: 53.34,2.54
N$88  (via drill 1)
  other vias: 50.8,2.54
N$89  (via drill 1)
  other vias: 48.26,2.54
N$90  (via drill 1)
  other vias: 45.72,2.54
N$91  (via drill 1)
  other vias: 43.18,2.54
N$183
  Top 0.508: Q80.E 27.62,64.68 R63.1
N$184
  Top 0.61: Q55.1 28.05,72.07 D17.A 26.67,70.69 Q80.C
N$185
  Top 1.016: D18.C D21.A
N$186  (via drill 0.35)
  Top 0.508: Q80.B 25.27,65.76 25.27,63.75 24,62.48 17.78,62.48 16.89,63.37 16.89,68.63 D21.C 13.92,70.28 v13.72,70.48 | R67.2 13.08,86.51 v13.08,86.36
  Bottom 0.508: v13.72,70.48 14.99,71.75 14.99,77.98 13.08,79.88 v13.08,86.36
N$187
  Top 0.305: D17.C 21.59,73.23 21.59,74.04 17.12,74.04 R69.2
  Top 0.61: Q56.1 19.16,70.78 R69.2
N$188
  Top 0.406: Q55.2 29.21,70 29.21,68.58 27.94,67.31 21.59,67.31 20.32,68.58 Q56.3
N$189
  Top 0.406: Q64.3 21.63,96.65 25.02,96.65 25.65,96.01 25.65,93.73 24,92.08 24,81.41 25.4,80.01 25.4,75.97 R64.2
  Top 0.508: R64.2 25.02,73.81 25.02,70.1 24.38,69.47 23.58,69.47 23.53,69.52 22.54,69.52 Q56.2
N$190
  Top 0.406: R64.1 22.45,77.7 21.55,76.79 19.48,76.79 18.95,77.32 R62.2 | R61.1 18.82,90.32 20.32,91.82 20.32,93.89 20.02,94.19 17.34,94.19 R65.2
  Top 0.508: R62.2 17.78,81.43 17.78,89.13 R61.1
N$191  (via drill 0.35)
  Top 0.406: Q62.C 20.32,78.74 20.83,79.25 20.83,81.93 20.69,82.07 20.69,88.53 v20.32,88.9 | v17.78,96.52 17.78,97.55 17.31,98.02 R65.1
  Top 0.813: Q57.E 17.23,98.02 R65.1
  Bottom 0.406: v20.32,88.9 17.78,91.44 v17.78,96.52
N$192
  Top 0.813: R70.1 23.57,98.58 D22.A 23.4,100.16 Q57.B
N$193
  Top 0.406: Q81.3 26.67,100.63 D22.C 27.92,99.38 Q58.B
N$194
  Top 0.61: R66.2 25.72,106.77 Q81.2
N$195
  Top 1.016: D24.A D23.C
N$196  (via drill 0.35)
  Top 0.406: Q57.C 21.63,97.96 v21.97,98.3 | v31.88,102.49 31.88,101.58 Q58.E
  Bottom 0.406: v21.97,98.3 22.61,98.93 29.97,98.93 31.88,100.84 v31.88,102.49
N$197
  Top 0.406: Q62.E 20.21,74.68 18.03,74.68 16.51,76.2 R69.1
N$198
  Top 0.406: Q64.2 22.24,93.13 R70.2
N$199
  Top 0.406: Q62.B 16.89,78.21 16.89,92.08 17.02,92.2 16.89,92.33 | 12.72,92.33 16.89,92.33 | Q64.1 18.57,92.33 16.89,92.33
  Top 0.508: R91.1 11.48,91.08 R80.2 12.72,92.33
N$200
  Top 0.61: Q63.B 32.53,72.07 Q55.3 31.58,69.51 Q65.C
N$201
  Top 0.406: Q65.B 30.63,67.31 33.19,67.31 33.34,67.46
  Top 0.61: Q63.E 34.29,69.07 Q66.C 33.34,67.46 Q66.B
N$202
  Top 0.61: R72.1 31.43,64.68 Q65.E
N$203
  Top 0.61: R73.1 35.24,64.68 Q66.E
  Top 0.813: Q66.E 37.48,66.21 D19.A
N$204
  Top 0.61: 33.93,75.29 Q67.3
  Top 1.016: Q63.C 35.39,73.66 33.93,75.12 33.93,75.29
N$205  (via drill 0.35)
  Top 0.813: R77.2 34.29,79.91
  Top 1.016: D19.C v38.1,72.39 | v35.56,80.01 35.46,79.91 34.29,79.91 Q67.1
  Bottom 1.016: v38.1,72.39 35.56,74.93 v35.56,80.01
N$206
  Top 0.61: Q73.1 35.24,103.99 Q73.3 | Q73.3 35.39,101.94 Q61.2 | Q73.3 33.63,103.04 Q72.1
N$207
  Top 0.61: Q73.2 33.34,106.77 R75.2 37.06,107.72 38.1,106.68 D20.C
N$208
  Top 0.61: R74.2 29.53,106.77 Q72.2
N$209
  Top 0.406: Q61.1 34.25,100.52 34.25,101.26 32.13,103.38 30.82,103.38 Q72.3
  Top 0.61: Q72.3 29.38,101.94 Q58.C
N$210
  Top 0.61: Q61.3 33.19,98.89 35.79,96.29 Q79.3
N$211  (via drill 0.35)
  Top 0.61: 40.39,91.57 39.27,91.57 Q79.1
  Top 1.016: 40.39,91.57 40.39,87.38 39.37,86.36 35.79,86.36 R77.1 v34.29,90.17 | D20.A v38.1,99.06
  Bottom 1.016: v38.1,99.06 38.1,93.98 v34.29,90.17
N$212
  Top 0.508: Q75.C 22.9,68.45 24.89,68.45 25.91,69.47 25.91,73.38 R76.1
  Top 0.61: R90.2 33.02,88.62 33.02,85.09 29.72,81.79 C17.1 27.37,77.91 C19.2 27.37,74.84 R76.1
  Top 0.813: C17.1 32.39,77.6 Q67.2 Q67.4
  Top 1.016: Q74.4 44.01,85.92 39.29,81.2 Q67.4 41.96,74.93 45.69,74.93 Q59.1
N$213
  Top 0.406: Q75.B 21.37,66.75 21.36,66.75 20.8,67.31 20.15,67.31 Q76.C
  Top 0.508: Q76.C 17.14,70.31 17.14,71.12 16.26,72.01 15.39,72.01 R82.2
  Top 1.016: Q76.B 18.1,67.46 Q76.C
N$214
  Top 0.406: Q77.1 24.64,106.07 24.64,108.08 23.5,109.22 21.84,109.22 20.7,108.08 20.7,105.94 Q78.1 20,103.99 Q78.3 18.88,102.87 14.48,102.87 13.46,101.85 13.46,98.53 R83.1
N$215
  Top 1.016: R85.1 20,64.68 Q76.E
N$216
  Top 1.016: R84.1 23.81,64.68 Q75.E
N$217  (via drill 0.35)
  Top 0.508: 13.69,76.71 13.44,76.96 v12.45,76.96 | v13.97,93.85 R83.2
  Top 0.61: IC3.6 IC3.7 v8.64,81.91 | R82.1 13.69,76.71
  Bottom 0.508: v12.45,76.96 12.45,78.1 v8.64,81.91 8.89,82.17 8.89,92.71 10.16,93.98 13.97,93.98 v13.97,93.85
N$218  (via drill 0.35)
  Top 0.406: 21.82,88.9 v21.82,88.65 | v40.77,80.52 43.81,80.52 45.59,78.74 50.8,78.74 R87.1
  Top 0.508: R68.1 v21.82,88.65 | R61.2 21.82,88.9
  Top 1.27: R88.2 49.53,92.2 49.53,80.01 50.8,78.74
  Bottom 0.406: v21.82,88.65 32.64,88.65 v40.77,80.52
N$219
  Top 0.61: R89.2 18.1,106.77 Q78.2
N$220
  Top 0.61: R86.2 21.91,106.77 Q77.2
N$221
  Top 0.813: Q68.1 56.89,72.13 54.61,69.85 45.72,69.85 43.18,72.39 43.41,72.62 Q59.3
  Top 1.27: Q68.1 56.89,82.29 59.46,84.86 R79.2
N$222
  Top 1.27: R79.1 57.63,87.86 56.13,86.36 53.34,86.36 52.45,87.25 52.45,88.77 53.59,89.92 53.98,89.92 55.12,91.06 55.12,98.17 53.19,100.1 Q69.1 Q60.3
N$223
  Top 0.406: Q77.3 23.03,102.87 24.13,102.87 25.4,101.6 25.4,98.7 R78.2 27.5,96.6 C20.1
  Top 0.508: Q79.4 32.33,93.34 27.69,93.34 27.5,93.53 C20.1
  Top 0.61: 26.79,88.78 RV3.1 | 26.79,88.78 29.34,86.23 RV3.2 30.7,85.31 26.92,81.53 C17.2 | 26.79,88.78 26.82,88.82 R90.1 26.82,93.94 C20.1
  Top 1.016: 35.56,93.98 Q79.4 | Q74.1 35.56,90.95 35.56,93.98 | Q60.1 41.15,97.81 41.15,95.12 40.01,93.98 Q79.2 35.56,93.98
N$224
  Top 1.27: Q68.3 54.61,74.9 R71.2 57.05,84.86 58.55,86.36 63.12,86.36 65.78,83.7 Q70.1
N$225
  Top 1.27: R71.1 56.89,90.14 Q69.3 Q71.1
N$226
  Top 1.27: Q70.3 61.22,77.97 R87.2
N$227
  Top 1.27: Q71.3 65.78,99.3 R88.1
N$228
  Top 0.61: C18.2 10.41,76.2 14.61,80.39 R81.2 14.58,81.15 13.34,81.15 12.57,81.91 IC3.2
N$229  (via drill 0.35)
  Top 0.508: R68.2 19.05,86.89 v19.05,85.6 C21.2 | v14.61,82.68 13.34,82.68 12.83,83.19 IC3.3
  Bottom 0.508: v19.05,85.6 16.13,82.68 v14.61,82.68
N$230  (via drill 0.35)
  Top 0.406: Q81.1 26.52,104.14 21.59,104.14 20.83,103.38 20.83,102.11 20.45,101.73 15.8,101.73 D23.A
  Top 0.508: D23.A v15.24,93.47 | R67.1 15.98,90.91 v16,90.93
  Bottom 0.508: v15.24,93.47 15.24,91.44 15.49,91.44 v16,90.93
N$231  (via drill 0.35)
  Top 0.61: RV3.3 26.67,84.16 v26.67,85.09 | v35.56,82.55 37.09,84.08 Q74.3
  Bottom 0.61: v26.67,85.09 33.02,85.09 v35.56,82.55
N$232
  Top 0.61: R92.1 3.3,79.25 3.81,78.74 3.81,78.61 C18.1 6.86,76.84 6.86,78.1 10.41,78.1 11.68,79.38 11.68,80.47 IC3.1
N$233
  Top 0.508: C22.2 4.06,84.81 R92.2 3.71,84.45 IC3.5
N$234  (via drill 1)
  other vias: 43.18,110.49
N$235  (via drill 1)
  other vias: 45.72,110.49
N$236  (via drill 1)
  other vias: 48.26,110.49
N$237  (via drill 1)
  other vias: 50.8,110.49
N$238  (via drill 1)
  other vias: 53.34,110.49
N$239  (via drill 1)
  other vias: 55.88,110.49
N$240  (via drill 1)
  other vias: 58.42,110.49
N$241  (via drill 1)
  other vias: 60.96,110.49
N$242  (via drill 1)
  other vias: 63.5,110.49
N$243  (via drill 1)
  other vias: 66.04,110.49
N$244  (via drill 1)
  other vias: 66.04,113.03
N$245  (via drill 1)
  other vias: 63.5,113.03
N$246  (via drill 1)
  other vias: 60.96,113.03
N$247  (via drill 1)
  other vias: 58.42,113.03
N$248  (via drill 1)
  other vias: 55.88,113.03
N$249  (via drill 1)
  other vias: 53.34,113.03
N$250  (via drill 1)
  other vias: 50.8,113.03
N$251  (via drill 1)
  other vias: 48.26,113.03
N$252  (via drill 1)
  other vias: 45.72,113.03
N$253  (via drill 1)
  other vias: 43.18,113.03
N$254  (via drill 1)
  other vias: 43.18,62.23
N$255  (via drill 1)
  other vias: 45.72,62.23
N$256  (via drill 1)
  other vias: 48.26,62.23
N$257  (via drill 1)
  other vias: 50.8,62.23
N$258  (via drill 1)
  other vias: 53.34,62.23
N$259  (via drill 1)
  other vias: 55.88,62.23
N$260  (via drill 1)
  other vias: 58.42,62.23
N$261  (via drill 1)
  other vias: 60.96,62.23
N$262  (via drill 1)
  other vias: 63.5,62.23
N$263  (via drill 1)
  other vias: 66.04,62.23
N$264  (via drill 1)
  other vias: 66.04,59.69
N$265  (via drill 1)
  other vias: 63.5,59.69
N$266  (via drill 1)
  other vias: 60.96,59.69
N$267  (via drill 1)
  other vias: 58.42,59.69
N$268  (via drill 1)
  other vias: 55.88,59.69
N$269  (via drill 1)
  other vias: 53.34,59.69
N$270  (via drill 1)
  other vias: 50.8,59.69
N$271  (via drill 1)
  other vias: 48.26,59.69
N$272  (via drill 1)
  other vias: 45.72,59.69
N$273  (via drill 1)
  other vias: 43.18,59.69